# EAGLE design CommutatorAdaptorEdge-New (EAGLE 9.6.2)
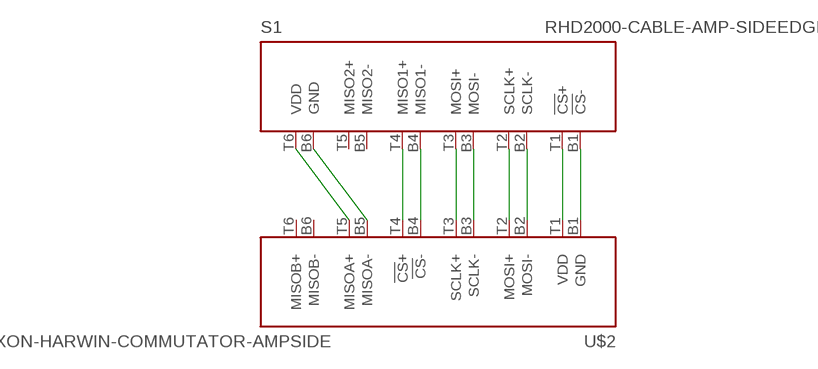
[diagram p0: schematic, sheet 1]

## Parts
S1  RHD2000-CABLE-AMP-SIDEEDGE  [OMNETICS_PZN-12-EDGE]
U$2  PLEXON-HARWIN-COMMUTATOR-AMPSIDE  [HARWIN-7+7-2MM-BOARDEDGE]

## Nets
N$1: S1.T1(!CS!+) U$2.T1(VDD)
N$2: S1.B1(!CS!-) U$2.B1(GND)
N$3: S1.B6(GND) U$2.B5(MISOA-)
N$4: S1.T4(MISO1+) U$2.T4(!CS!+)
N$5: S1.B4(MISO1-) U$2.B4(!CS!-)
N$6: S1.T6(VDD) U$2.T5(MISOA+)
N$8: S1.T3(MOSI+) U$2.T3(SCLK+)
N$9: S1.B3(MOSI-) U$2.B3(SCLK-)
N$10: S1.T2(SCLK+) U$2.T2(MOSI+)
N$11: S1.B2(SCLK-) U$2.B2(MOSI-)
Unconnected: S1.B5(MISO2-) S1.T5(MISO2+) U$2.B6(MISOB-) U$2.T6(MISOB+)

## Library data of the parts
S1 = CommutatorConnectors:RHD2000-CABLE-AMP-SIDE: Omnetics A79623 PZN-12-AA connector for SPI interface (amplifier side)
U$2 = CommutatorConnectors:PLEXON-HARWIN-COMMUTATOR-AMPSIDE

## Board
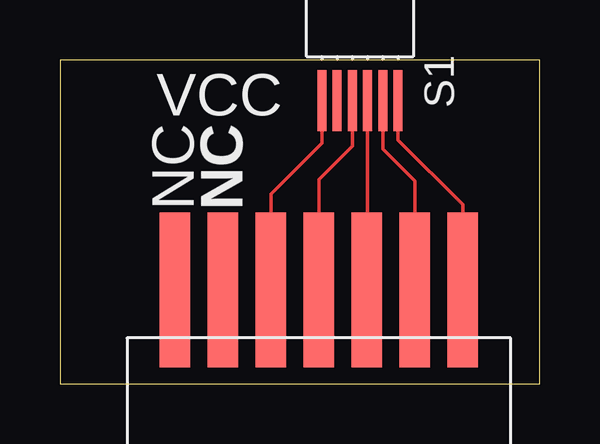
[diagram p1: board, top side]
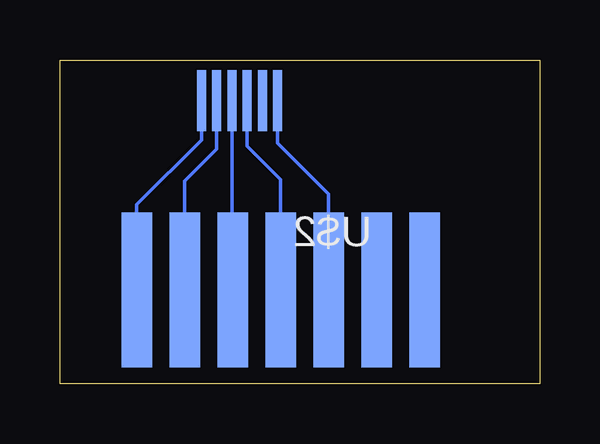
[diagram p2: board, bottom side, seen from below]

Size 20 x 13.5 mm. Coordinates in mm from the lower left corner, seen from the top.
Outline: 0,0 20,0 20,13.5 0,13.5 0,0
Copper layers (1*16): Top 0.035559375mm / dielectric 1.6mm / Bottom 0.035559375mm
Design rules "oshpark-2layer": minimum track width 6mil, minimum drill 10mil, track to track 6mil, track to pad 6mil, pad to pad 6mil, via to via 6mil, smd to smd 6mil, copper to edge 15mil, drill to drill 6mil, minimum pad ring 5mil, minimum via ring 5mil, stop-mask expansion 2.5mil, vias tented up to drill 0mil, thermal gap 10mil

### Footprints (pad centres in the part's own frame; a part is rotated, then mirrored left to right if it is on the bottom)
OMNETICS_PZN-12-EDGE = smd 0.381 x 2.54 bottom: B1 1.587,-2.159; B2 0.953,-2.159; B3 0.318,-2.159; B4 -0.318,-2.159; B5 -0.953,-2.159; B6 -1.587,-2.159 | smd 0.381 x 2.54: T1 1.587,-2.159; T2 0.953,-2.159; T3 0.318,-2.159; T4 -0.318,-2.159; T5 -0.953,-2.159; T6 -1.587,-2.159
HARWIN-7+7-2MM-BOARDEDGE = smd 1.27 x 6.452 bottom: B1 6,2; B2 4,2; B3 2,2; B4 0,2; B5 -2,2; B6 -4,2; B7 -6,2 | smd 1.27 x 6.452: T1 6,2; T2 4,2; T3 2,2; T4 0,2; T5 -2,2; T6 -4,2; T7 -6,2

### Placement (x,y rotation side)
S1  12.51,13.97 0 top
U$2  10.79,1.91 0 top

### Tracks (layer width: path | path; a pad name or v marks a point on that pad's centre or on a via)
N$1
  Top 0.152: S1.T1 14.1,10.16 16.8,7.46 U$2.T1
N$2
  Bottom 0.152: U$2.B1 16.8,7.46 14.1,10.16 S1.B1
N$3
  Bottom 0.152: S1.B6 10.92,10.03 8.79,7.91 U$2.B5
N$4
  Top 0.152: S1.T4 12.19,9.91 10.79,8.51 U$2.T4
N$5
  Bottom 0.152: S1.B4 12.19,9.91 10.79,8.51 U$2.B4
N$6
  Top 0.152: U$2.T5 8.79,7.91 10.92,10.03 S1.T6
N$8
  Top 0.152: S1.T3 12.83,3.94 U$2.T3
N$9
  Bottom 0.152: S1.B3 12.83,3.94 U$2.B3
N$10
  Top 0.152: S1.T2 13.46,9.78 13.65,9.59 13.72,9.53 14.79,8.45 U$2.T2
N$11
  Bottom 0.152: S1.B2 13.46,9.78 14.79,8.45 U$2.B2

### Text on the board
tPlace: VCC | NC | NC